# Altium schematic sheet Stepper_Motor_Driver.SchDoc
size A4
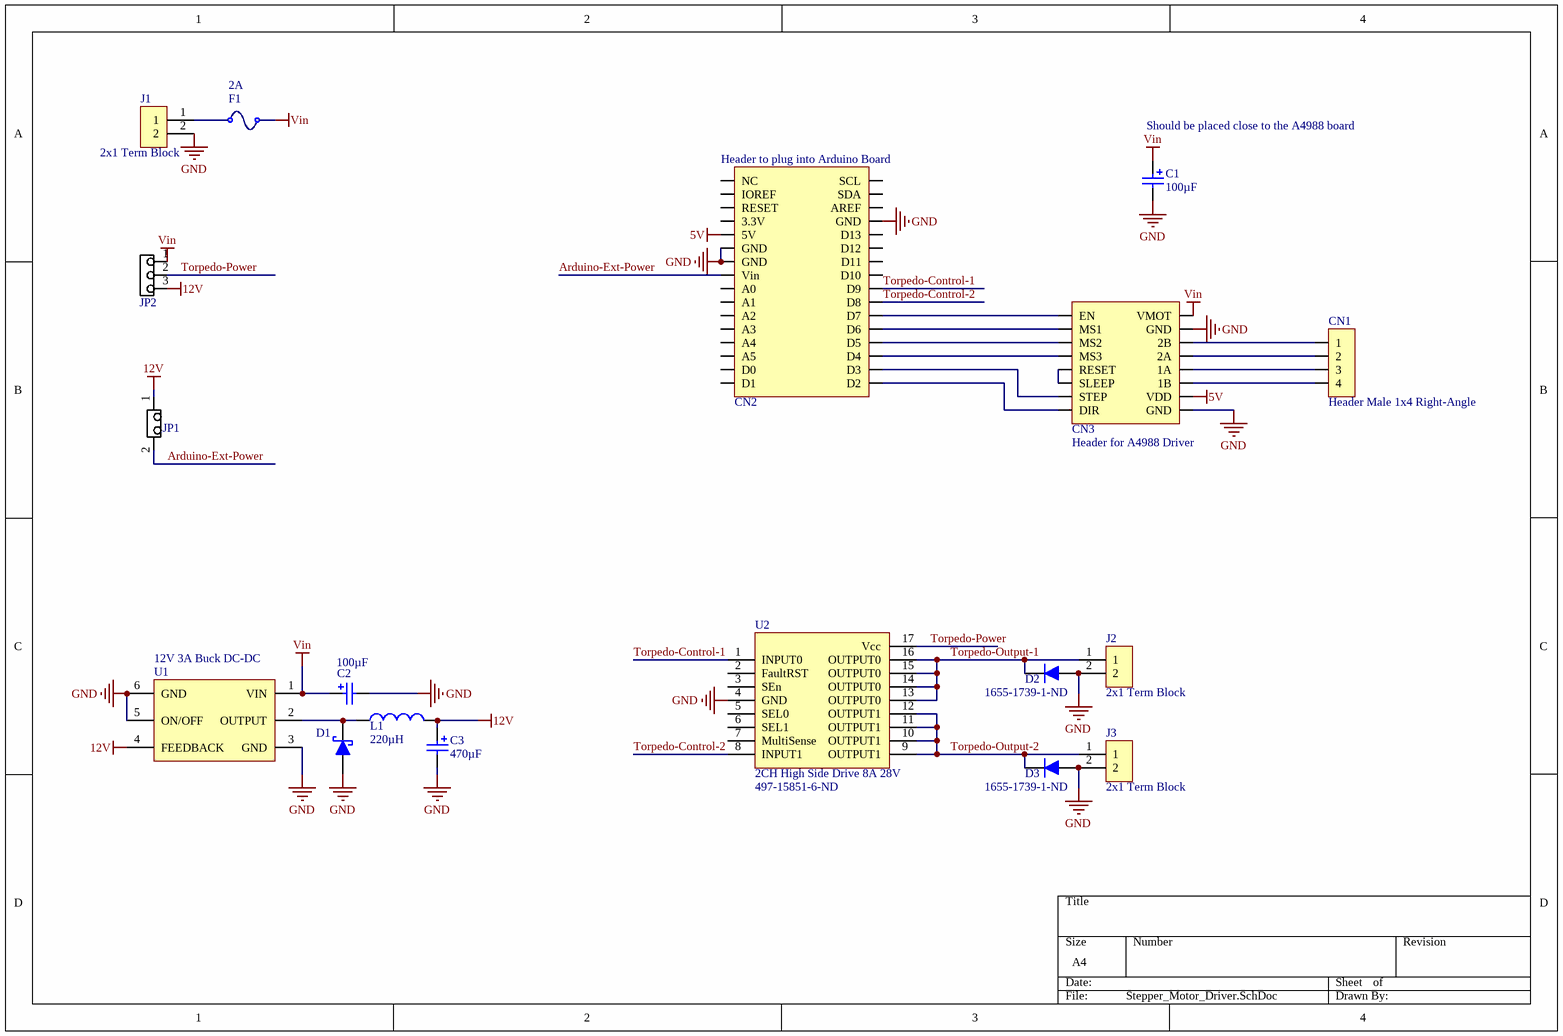
[diagram p0: Stepper_Motor_Driver.SchDoc]

## Parts
C1  100µF  [Radial_CAN_6.6mm]
C2  100µF  [Radial_CAN_6.6mm]
C3  470µF  [EEE-1HA221P]
CN1  Header Male 1x4 Right-Angle  [Header, Male, 1X4, More solder]
CN2  Header to plug into Arduino Board  [DIP32 Arduino Shield]
CN3  Header for A4988 Driver  [DIP16]
D1  TSSA5U50E3GCT-ND  [DO-214AC]  (value not drawn)
D2  Supplier Part Number 1: 1655-1739-1-ND  [DO-214AA]  (hidden comment: JD 2A 600V)
D3  Supplier Part Number 1: 1655-1739-1-ND  [DO-214AA]  (hidden comment: JD 2A 600V)
F1  2A  [1206 SMD]
J1  2x1 Term Block  [2X1 Terminal Blocks]
J2  2x1 Term Block  [2X1 Terminal Blocks]
J3  2x1 Term Block  [2X1 Terminal Blocks]
JP1  1X2 Pin Head  [2X1 Males Header]  (value not drawn)
JP2  1x3 Male Jumper  [Header, Male, 1x3, Pitch: 0.1" (2.54mm),THT]  (value not drawn)
L1  220µH  [Inductor Cylinder - 1422435C]
U1  12V 3A Buck DC-DC  [5-DDPAK]
U2  2CH High Side Drive 8A 28V  Supplier Part Number 1: 497-15851-6-ND  [SSOP50P600X170_HS-17N]

## Nets
5V: CN2.5(5V) CN3.10(VDD)
12V: C3.1(Anode) JP1.1 JP2.3 L1.2 U1.4(FEEDBACK)
GND: C1.2(Cathode) C2.2(Cathode) C3.2(Cathode) CN2.6(GND) CN2.7(GND) CN2.29(GND) CN3.9(GND) CN3.15(GND) D1.1(Anode) D2.A(Anode) D3.A(Anode) J1.2 J2.2 J3.2 U1.3(GND) U1.5(ON/OFF) U1.6(GND) U2.4(GND)
Vin: C1.1(Anode) C2.1(Anode) CN3.16(VMOT) F1.2 JP2.1 U1.1(VIN)
Arduino-Ext-Power: CN2.8(Vin) JP1.2
Torpedo-Control-1: CN2.24(D9) U2.1(INPUT0)
Torpedo-Control-2: CN2.23(D8) U2.8(INPUT1)
Torpedo-Output-1: D2.K(Cathode) J2.1 U2.13(OUTPUT0) U2.14(OUTPUT0) U2.15(OUTPUT0) U2.16(OUTPUT0)
Torpedo-Output-2: D3.K(Cathode) J3.1 U2.9(OUTPUT1) U2.10(OUTPUT1) U2.11(OUTPUT1) U2.12(OUTPUT1)
Torpedo-Power: JP2.2 U2.17(Vcc)
NetCN1_1: CN1.1 CN3.14(2B)
NetCN1_2: CN1.2 CN3.13(2A)
NetCN1_3: CN1.3 CN3.12(1A)
NetCN1_4: CN1.4 CN3.11(1B)
NetCN2_17: CN2.17(D2) CN3.8(DIR)
NetCN2_18: CN2.18(D3) CN3.7(STEP)
NetCN2_19: CN2.19(D4) CN3.4(MS3)
NetCN2_20: CN2.20(D5) CN3.3(MS2)
NetCN2_21: CN2.21(D6) CN3.2(MS1)
NetCN2_22: CN2.22(D7) CN3.1(EN)
NetCN3_5: CN3.5(RESET) CN3.6(SLEEP)
NetD1_2: D1.2(Cathode) L1.1 U1.2(OUTPUT)
NetF1_1: F1.1 J1.1

Not connected (* = marked no-connect by the designer): CN2 1(NC) 2(IOREF) 3(RESET) 4(3.3V) 9(A0) 10(A1) 11(A2) 12(A3) 13(A4) 14(A5) 15(D0) 16(D1) 25(D10) 26(D11) 27(D12) 28(D13) 30(AREF) 31(SDA) 32(SCL); U2 2(FaultRST) 3(SEn) 5(SEL0) 6(SEL1) 7(MultiSense)

## Notes on the sheet
- (near C1) Should be placed close to the A4988 board

## Library data of the parts
C1 C2 = 100uF, 35V, 20%, Alum, SMD: 100µF 35V Aluminum Electrolytic Capacitors Radial, Can - SMD 1000 Hrs @ 105°C; Created By: Poorna Chander Kalidas; PackageDescription: Can; Value: 100µF; Date Created: 2018-06-01; Supplier 1: Digi-Key; Supplier Part Number 1: 493-2203-2-ND
C3 = 470uF 25V SMD Aluminum Nichicon: 470µF 25V Aluminum Electrolytic Capacitors Radial, Can - SMD 1000 Hrs @ 105°C; Publisher: Poorna Chander Kalidas; PackageDescription: Chip Capacitor; Value: 470µF; Supplier 1: Digi-Key; Supplier Part Number 1: 493-2194-1-ND
CN1 = Header, Male, 1x4, Right-Angle: 1x4, Pads Pitch: 0.1" (2.54mm), Right-angle, Through hole; Made Bates: Poorna Chander Kalidas; Supplier 1: Digi-Key; Supplier Part Number 1: 952-1965-ND; ComponentLink1Description: Harwin Inc. M20-9750446; ComponentLink1URL: https://www.digikey.ca/product-detail/en/harwin-inc/M20-9750446/952-1965-ND/3727931
CN2 = Arduino Shield Heade: 1x8 Header  x2 / 1x10 Header / 1.6 Header / Pitch: 0.1" (2.54mm), Contact Length 0.394" (10.00mm) Through hole; Made Bates: Poorna Chander Kalidas; Supplier 1: Digi-Key; Supplier 2: Digi-Key; Supplier 3: Digi-Key; Supplier Part Number 1: SAM8866-ND; Supplier Part Number 2: SSW-110-03-T-S-ND; Supplier Part Number 3: SAM8865-ND
CN3 = Connector for A4988 Stepper Motor Driver: Header, Female, 2x8, Pitch: 0.1" (2.54mm),THT; Supplier 1: Digi-Key; Created By: Poorna Chander Kalidas; Supplier Part Number 1: 1212-1097-ND
D1 = TSSA5U50E3GCT-ND: Diode Schottky 50V 5A Surface Mount DO-214AC (SMA); Created By: Poorna Chander Kalidas; Date Created: 2018-06-01; Supplier 1: Digi-Key; Supplier Part Number 1: TSSA5U50 E3GCT-ND
D2 D3 = JD 2A 600V: Junction Diode 2A 600V; Created By: Poorna Chander Kalidas; Publisher: AUVic; Date Created: 2018-06-07; ComponentLink1Description: Digi-Key; ComponentLink1URL: https://www.digikey.ca/product-detail/en/smc-diode-solutions/S2JTR/1655-1739-1-ND/6674450; Supplier 1: Digi-Key
F1 = SMD Fuse, 2A, 63V,: Created By: Poorna Chander Kalidas; Date Created: 2018-06-07; Type: SMD; Supplier 1: Digi-Key; ComponentLink1Description: Digi-Key; ComponentLink1URL: https://www.digikey.ca/product-detail/en/bel-fuse-inc/C1F-2/507-1881-1-ND/4968159; Supplier Part Number 1: 507-1881-6-ND; Current: 2A
J1-J3 = 2x1 Terminal Block: Made by: Andy Bates; Supplier 1: Digikey; Supplier Part Number 1: ED2740-ND
JP1 = 1x2 Male Header: Made By: Andy Bates; Supplier 1: Digikey; Supplier 1 Part Number: 952-3073-ND
JP2 = 1x3 Male Jumper: Made By: Poorna Chander Kalidas; Supplier 1: Digi-Key; Supplier Part Number: 1849-1003-ND
L1 = 220µH 3.5A Inductor: 220µH Unshielded Wirewound Inductor 3.5A 96 mOhm Max Radial; Created By: Poorna Chander Kalidas; Created On: 2018-06-01; Supplier 1: Digi-Key; Supplier Part Number 1: 811-1340-ND; Value: 220µH; ComponentLink1Description: 811-1340-ND; ComponentLink1URL: https://www.digikey.ca/product-detail/en/murata-power-solutions-inc/1422435C/811-1340-ND/1924834
U1 = 12V 3A Buck DC-DC: Buck Switching Regulator IC Positive Fixed 12V 1 Output 3A TO-263-6, D²Pak (5 Leads + Tab), TO-263BA; Supplier 1: Digi-Key; Created By: Poorna Chander Kalidas; Supplier Part Number 1: 576-2130-ND; ComponentLink1Description: Digi-Key; ComponentLink1URL: https://www.digikey.ca/product-detail/en/microchip-technology/LM2576-12WU/576-2130-ND/1027675
U2 = 2CH High Side Drive w/ Logic Signal 8A 28V: 2 Channel High Side Drive MOSFET controlable by logic signal; Supplier 1: Digi-Key